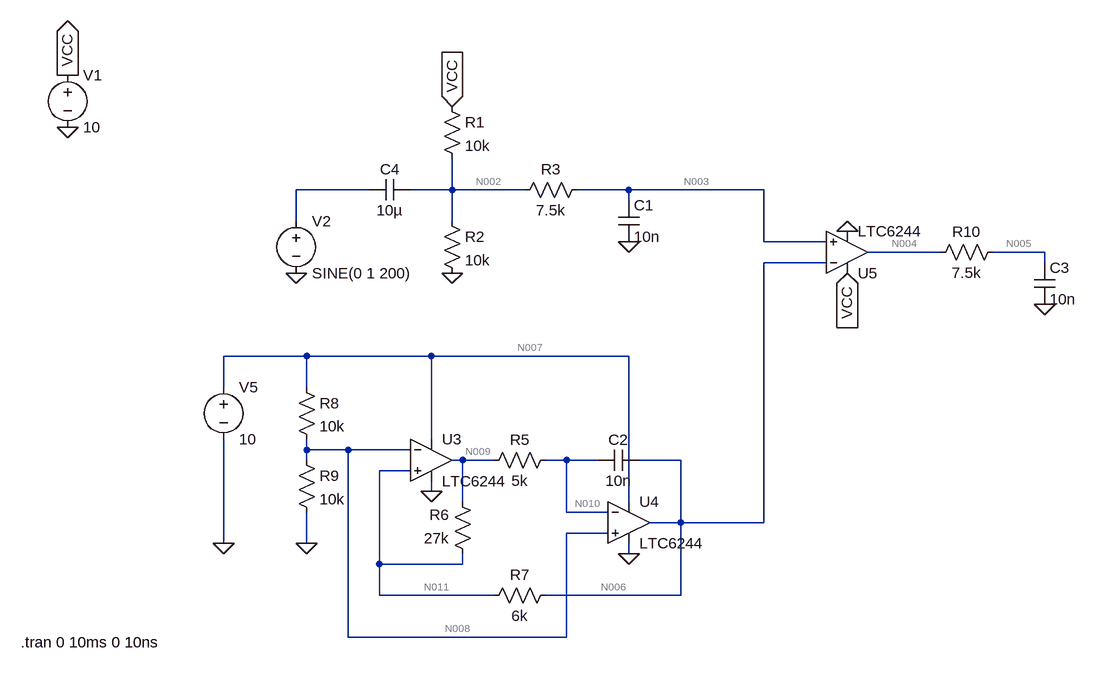
[diagram p0: schematic NewCombinedInput_CapacitorBias.asc]
NewCombinedInput_CapacitorBias.asc, the LTspice schematic file:
Version 4
SHEET 1 1496 904
WIRE 384 192 272 192
WIRE 512 192 512 144
WIRE 512 192 448 192
WIRE 624 192 512 192
WIRE 784 192 704 192
WIRE 992 192 784 192
WIRE 784 208 784 192
WIRE 272 240 272 192
WIRE 512 240 512 192
WIRE 992 272 992 192
WIRE 1088 272 992 272
WIRE 1264 288 1152 288
WIRE 1424 288 1344 288
WIRE 1088 304 992 304
WIRE 1424 304 1424 288
WIRE 288 448 160 448
WIRE 480 448 288 448
WIRE 784 448 480 448
WIRE 160 496 160 448
WIRE 288 496 288 448
WIRE 480 576 480 448
WIRE 288 592 288 576
WIRE 352 592 288 592
WIRE 448 592 352 592
WIRE 288 608 288 592
WIRE 528 608 512 608
WIRE 576 608 528 608
WIRE 688 608 656 608
WIRE 736 608 688 608
WIRE 864 608 800 608
WIRE 448 624 400 624
WIRE 480 656 480 640
WIRE 528 672 528 608
WIRE 784 672 784 448
WIRE 688 688 688 608
WIRE 752 688 688 688
WIRE 864 704 864 608
WIRE 864 704 816 704
WIRE 992 704 992 304
WIRE 992 704 864 704
WIRE 752 720 688 720
WIRE 160 736 160 576
WIRE 288 736 288 688
WIRE 784 752 784 736
WIRE 400 768 400 624
WIRE 528 768 528 752
WIRE 528 768 400 768
WIRE 400 816 400 768
WIRE 576 816 400 816
WIRE 864 816 864 704
WIRE 864 816 656 816
WIRE 352 880 352 592
WIRE 688 880 688 720
WIRE 688 880 352 880
FLAG -80 96 0
FLAG -80 16 VCC
IOPIN -80 16 Out
FLAG 1120 320 VCC
IOPIN 1120 320 In
FLAG 1120 256 0
FLAG 288 736 0
FLAG 480 656 0
FLAG 784 752 0
FLAG 160 736 0
FLAG 1424 368 0
FLAG 512 320 0
FLAG 512 64 VCC
IOPIN 512 64 In
FLAG 784 272 0
FLAG 272 320 0
SYMBOL voltage -80 0 R0
WINDOW 123 0 0 Left 0
WINDOW 39 0 0 Left 0
SYMATTR InstName V1
SYMATTR Value 10
SYMBOL Opamps\\LTC6244 1120 288 M180
SYMATTR InstName U5
SYMBOL res 672 592 R90
WINDOW 0 0 56 VBottom 2
WINDOW 3 32 56 VTop 2
SYMATTR InstName R5
SYMATTR Value 5k
SYMBOL res 544 768 R180
WINDOW 0 36 76 Left 2
WINDOW 3 36 40 Left 2
SYMATTR InstName R6
SYMATTR Value 27k
SYMBOL res 672 800 R90
WINDOW 0 0 56 VBottom 2
WINDOW 3 32 56 VTop 2
SYMATTR InstName R7
SYMATTR Value 6k
SYMBOL cap 800 592 R90
WINDOW 0 0 32 VBottom 2
WINDOW 3 32 32 VTop 2
SYMATTR InstName C2
SYMATTR Value 10n
SYMBOL res 272 480 R0
SYMATTR InstName R8
SYMATTR Value 10k
SYMBOL res 272 592 R0
SYMATTR InstName R9
SYMATTR Value 10k
SYMBOL voltage 160 480 R0
SYMATTR InstName V5
SYMATTR Value 10
SYMBOL OpAmps\\LTC6244 480 608 R0
SYMATTR InstName U3
SYMBOL OpAmps\\LTC6244 784 704 R0
SYMATTR InstName U4
SYMBOL cap 1408 304 R0
SYMATTR InstName C3
SYMATTR Value 10n
SYMBOL res 1360 272 R90
WINDOW 0 0 56 VBottom 2
WINDOW 3 32 56 VTop 2
SYMATTR InstName R10
SYMATTR Value 7.5k
SYMBOL res 496 48 R0
SYMATTR InstName R1
SYMATTR Value 10k
SYMBOL res 496 224 R0
SYMATTR InstName R2
SYMATTR Value 10k
SYMBOL cap 768 208 R0
SYMATTR InstName C1
SYMATTR Value 10n
SYMBOL res 720 176 R90
WINDOW 0 0 56 VBottom 2
WINDOW 3 32 56 VTop 2
SYMATTR InstName R3
SYMATTR Value 7.5k
SYMBOL cap 448 176 R90
WINDOW 0 0 32 VBottom 2
WINDOW 3 32 32 VTop 2
SYMATTR InstName C4
SYMATTR Value 10µ
SYMBOL voltage 272 224 R0
WINDOW 123 0 0 Left 0
WINDOW 39 0 0 Left 0
SYMATTR InstName V2
SYMATTR Value SINE(0 1 200)
TEXT -152 888 Left 2 !.tran 0 10ms 0 10ns

The netlist it stands for:
* NewCombinedInput_CapacitorBias.asc
V1 VCC 0 10
XU5 N003 N006 VCC 0 N004 LTC6244  ; pins In+ In- V+ V- OUT
R5 N010 N009 5k
R6 N011 N009 27k
R7 N006 N011 6k
C2 N006 N010 10n
R8 N007 N008 10k
R9 N008 0 10k
V5 N007 0 10
XU3 N011 N008 N007 0 N009 LTC6244  ; pins In+ In- V+ V- OUT
XU4 N008 N010 N007 0 N006 LTC6244  ; pins In+ In- V+ V- OUT
C3 N005 0 10n
R10 N005 N004 7.5k
R1 VCC N002 10k
R2 N002 0 10k
C1 N003 0 10n
R3 N003 N002 7.5k
C4 N002 N001 10µ
V2 N001 0 SINE(0 1 200)
.tran 0 10ms 0 10ns
.backanno
.end

* Results of the author's LTspice run, read from the files saved beside the schematic
* Operating Point, zero values left out:
*   V(vcc) = 10 V
*   V(n006) = 5 V
*   V(n003) = 5 V
*   V(n004) = 4.939 V
*   V(n010) = 5 V
*   V(n009) = 5 V
*   V(n011) = 5 V
*   V(n007) = 10 V
*   V(n008) = 5 V
*   V(n005) = 4.939 V
*   V(n002) = 5 V
*   I(R2) = 500 µA
*   I(R1) = 500 µA
*   I(R9) = 500 µA
*   I(R8) = 500 µA
*   I(V5) = -12.08 mA
*   I(V1) = -6.288 mA
*   Ix(u5:3) = 5.788 mA
*   Ix(u5:4) = -5.788 mA
*   Ix(u3:3) = 5.788 mA
*   Ix(u3:4) = -5.788 mA
*   Ix(u4:3) = 5.788 mA
*   Ix(u4:4) = -5.788 mA